# Altium schematic sheet 3_Alimentacion.SchDoc
size A4; SheetNumber: 4; SheetTotal: 4
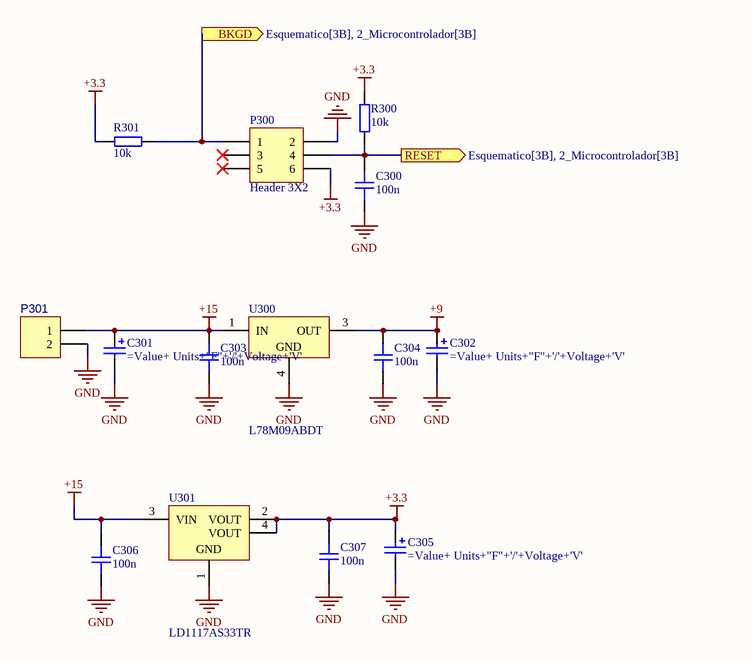
[diagram p0: 3_Alimentacion.SchDoc]

## Parts
C300  100n  [CAP_0603]
C301  (no value)  [C SIZE SMD CAPACITOR]
C302  (no value)  [C SIZE SMD CAPACITOR]
C303  100n  [CAP_0603]
C304  100n  [CAP_0603]
C305  (no value)  [C SIZE SMD CAPACITOR]
C306  100n  [CAP_0603]
C307  100n  [CAP_0603]
P300  Header 3X2  [HDR2X3]
P301  Conector Molex 2 vias Macho  [MOLEX INDENT 2 LOW PRF]  (value not drawn)
R300  10k  [RES_0603]
R301  10k  [RES_0603]
U300  L78M09ABDT  [TO-252]
U301  LD1117AS33TR  [SOT-223_N]

## Ports
BKGD (out, see Esquematico[3B], 2_Microcontrolador[3B]), RESET (out, see Esquematico[3B], 2_Microcontrolador[3B])

## Nets
+3.3: C305.1 C307.1 P300.6 R300.1 R301.2 U301.2(VOUT) U301.4(VOUT)
+9: C302.1 C304.1 U300.3(OUT)
+15: C301.1 C303.1 C306.1 P301.1 U300.1(IN) U301.3(VIN)
GND: C300.2 C301.2 C302.2 C303.2 C304.2 C305.2 C306.2 C307.2 P300.2 P301.2 U300.4(GND) U301.1(GND)
BKGD: P300.1 R301.1 ; port BKGD
RESET: C300.1 P300.4 R300.2 ; port RESET

Not connected (* = marked no-connect by the designer): P300 3* 5*

## Library data of the parts
C300 C303 C304 C306 C307 = CAP_0603: Capacitor SMD 0603; Manufacturer: *; Manufacturer Part Number: *; Distributor Link: *; LCSC: *; Rating: *; Dielectric: *
C301 C302 C305 = Cap Pol1: Capacitor Electr. Alum. SMD WxLxH 6.3x6.3x5.3 Ǿ= 6 mm; Manufacturer: Generic Components; Class: Passive; Value: 47; PDT: PDT_GA500P+; CRITICO: NO; Voltage: 16; Diam: 6.3; Units: u; ASY_DESCRIPTION: Electrónica Galert 500P+; ASY_CRITICO: S; ELEMON: EH51EM470E05OC; Published: 08/06/2000; Publisher: Altium Hobart Technology Centre; SubClass: Capacitor; GAMMASYS: =C+auto_range + ''+Exponent+Material+Voltage+ PackageReference; ASY: =PS+PCB+'R'+PCB_REV; PackageReference: 0607; Height: 10; auto_range: =(NORM >= 1) * (NORM < 100) * NORM + (NORM >= 1E2) * (NORM < 1E3) * NORM / 10 + (NORM >= 1E3) * (NORM < 1E4) * NORM / 1E2 + (NORM >= 1E4) * (NORM < 1E5) * NORM / 1E3 + (NORM >= 1E5) * (NORM < 1E6) * NORM / 1E4 + (NORM >= 1E6) * (NORM < 1E7) * NORM / 1E5 + (NORM >= 1E7) * (NORM < 1E8) * NORM / 1E6 + (NORM >= 1E8) * (NORM < 1E9) * NORM / 1E7 + (NORM >= 1E9) * (NORM < 1E10) * NORM / 1E8 + (NORM >= 1E10) * (NORM < 1E11) * NORM / 1E9; Exponent: =(NORM >= 1) * (NORM < 1E2) * 0 || (NORM >= 1E2) * (NORM < 1E3) * 1 || (NORM >= 1e3) * (NORM < 1e4) * 2 ||(NORM >= 1E4) * (NORM < 1E5) * 3 || (NORM >= 1E5) * (NORM < 1E6) * 4 || (NORM >= 1E6) * (NORM < 1E7) * 5 || (NORM >= 1E7) * (NORM < 1E8) * 6 || (NORM >= 1E8) * (NORM < 1E9) * 7 || (NORM >= 1E9) * (NORM < 1E10) * 8 || (NORM >= 1E10) * (NORM < 1E11) * 9; NORM: =-(not (Units <> m) * 1E3 + not (Units <> u)*1E0 )*Value
P300 = Header 3X2: Header, 3-Pin, Dual row; LatestRevisionDate: 17-Jul-2002; LatestRevisionNote: Re-released for DXP Platform.; Publisher: Altium Limited
P301 = Header 2: Header, 2-Pin; PDT: PDT_GA500P+; CRITICO: NO; ASY_DESCRIPTION: Electrónica Galert 500P+; ASY_CRITICO: S; SYC: 2317SJ-02; LatestRevisionDate: 17-Jul-2002; LatestRevisionNote: Re-released for DXP Platform.; Publisher: Altium Limited; GAMMASYS: ='P2317SJ-02'; ASY: =PS+PCB+'R'+PCB_REV
R300 R301 = RES_0603: Resistor SMD 0603; Manufacturer: *; Manufacturer Part Number: *; Distributor Link: *; LCSC: *
U300 = L78M09ABDT: Precision 500mA Regulator; Published: 24-Aug-2001; LatestRevisionDate: 06-Jun-2005; LatestRevisionNote: PCB pads lengthened.; DatasheetVersion: Mar-1997; PackageVersion: Jun-2004; PackageReference: TO-252; Publisher: Altium Limited; PackageDescription: D-PAK/TO-252-AA; 3 Leads (1 Cropped); Body 10.1 (inc. leads) x 6.6 mm (LxW max); ComponentLink1Description: Manufacturer Link; ComponentLink1URL: http://www.st.com/; ComponentLink2Description: Datasheet; ComponentLink2URL: http://www.st.com/stonline/products/literature/ds/2147/l78m05ab.pdf
U301 = LD1117AS33TR: 1A, Low Drop Positive Voltage Regulator, 3.3V, 4-Pin SOT-223, Tape and Reel; DatasheetVersion: Dec-2011; PackageVersion: 2010; PackageReference: SOT-223; PackageDescription: 4-Pin SOT-223 Package, 6.5 x 3.5 mm Body, 2.3 mm Pitch, 7 mm Lead Span; PartNumber: LD1117AS33TR; ComponentLink1Description: Manufacturer URL; ComponentLink1URL: http://www.st.com; ComponentLink2Description: Datasheet; ComponentLink2URL: http://www.st.com/internet/com/TECHNICAL_RESOURCES/TECHNICAL_LITERATURE/DATASHEET/CD00002116.pdf